# EAGLE schematic longranger-001 (EAGLE 8.7.0)
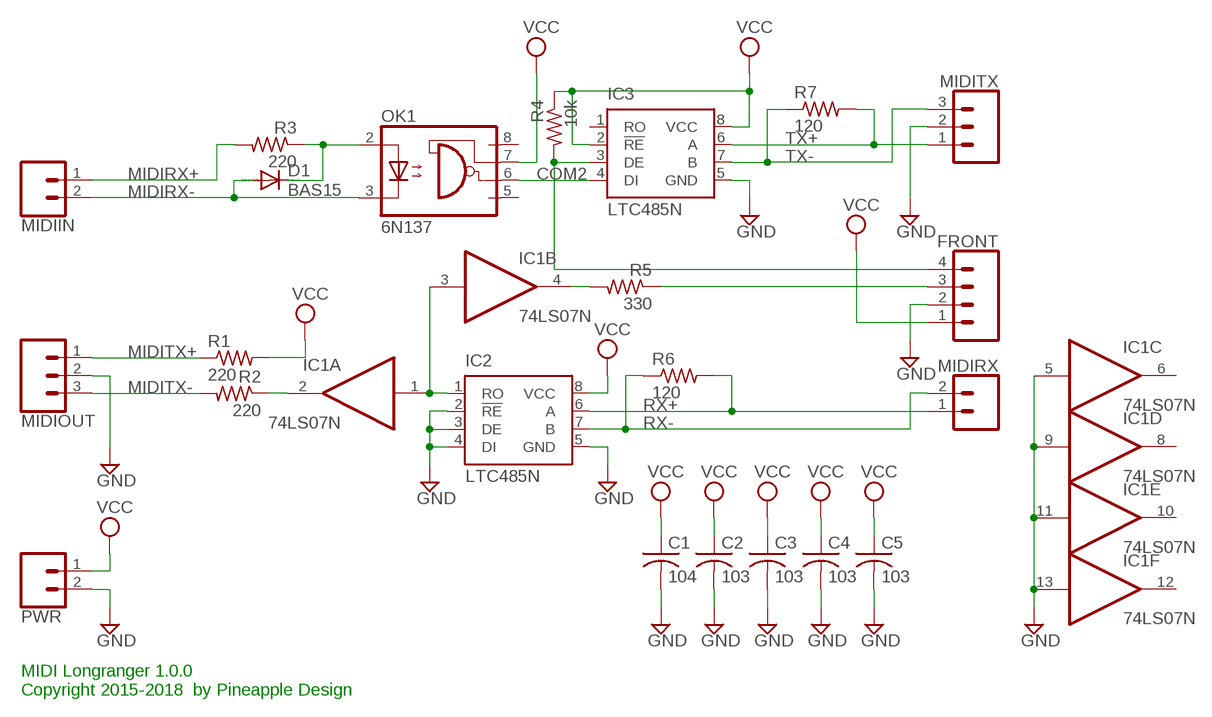
[diagram p0: schematic, sheet 1]

## Parts
C1  104  C-US025-025X050  [C025-025X050]
C2  103  C-US025-025X050  [C025-025X050]
C3  103  C-US025-025X050  [C025-025X050]
C4  103  C-US025-025X050  [C025-025X050]
C5  103  C-US025-025X050  [C025-025X050]
D1  BAS15  [DO34-7]
FRONT  CONN_04JST-PTH  [JST-4-PTH]
IC1  74LS07N  [DIL14]
IC2  LTC485N  [DIL08]
IC3  LTC485N  [DIL08]
MIDIIN  CONN_02JST-PTH-2  [JST-2-PTH]
MIDIOUT  CONN_03JST-PTH  [JST-3-PTH]
MIDIRX  CONN_02JST-PTH-2  [JST-2-PTH]
MIDITX  CONN_03JST-PTH  [JST-3-PTH]
OK1  6N137  [DIL08]
PWR  CONN_02JST-PTH-2  [JST-2-PTH]
R1  220  R-US_0204/5  [0204/5]
R2  220  R-US_0204/5  [0204/5]
R3  220  R-US_0204/5  [0204/5]
R4  10k  R-US_0204/5  [0204/5]
R5  330  R-US_0204/5  [0204/5]
R6  120  R-US_0204/5  [0204/5]
R7  120  R-US_0204/5  [0204/5]

## Nets
COM2: IC3.4(DI) OK1.6(VO)
GND: C1.2 C2.2 C3.2 C4.2 C5.2 FRONT.2 IC1.5(C:I) IC1.9(D:I) IC1.11(E:I) IC1.13(F:I) IC2.2(!RE) IC2.3(DE) IC2.4(DI) IC2.5(GND) IC3.5(GND) MIDIOUT.2 MIDITX.2 PWR.2
MIDIRX+: MIDIIN.1 R3.2
MIDIRX-: D1.A MIDIIN.2 OK1.3(C)
MIDITX+: MIDIOUT.1 R1.1
MIDITX-: MIDIOUT.3 R2.2
N$1: IC1.1(A:I) IC1.3(B:I) IC2.1(RO)
N$2: IC1.2(A:O) R2.1
N$3: IC1.4(B:O) R5.2
N$4: FRONT.3 R5.1
N$6: FRONT.4 IC3.3(DE) R4.2
N$15: D1.C OK1.2(A) R3.1
RX+: IC2.6(A) MIDIRX.1 R6.2
RX-: IC2.7(B) MIDIRX.2 R6.1
TX+: IC3.6(A) MIDITX.1 R7.2
TX-: IC3.7(B) MIDITX.3 R7.1
VCC: C1.1 C2.1 C3.1 C4.1 C5.1 FRONT.1 IC2.8(VCC) IC3.2(!RE) IC3.8(VCC) OK1.7(VE) PWR.1 R1.2 R4.1
Unconnected: IC1.6(C:O) IC1.8(D:O) IC1.10(E:O) IC1.12(F:O) IC3.1(RO) OK1.5(GND) OK1.8(VCC)

## Notes on the sheet
- MIDI Longranger 1.0.0
  Copyright 2015-2018  by Pineapple Design

## Power pins joined to a net without a drawn wire
GND: IC1.7(P:GND)
VCC: IC1.14(P:VCC)

## Library data of the parts
C1-C5 = rcl:C-US: CAPACITOR, American symbol; SPICEPREFIX: C
D1 = diode:BAS15: DIODE high speed
FRONT = SparkFun-Connectors:CONN_04: Multi connection point. Often used as Generic Header-pin footprint for 0.1 inch spaced/style header connections On any of the 0.1 inch spaced packages, you can populate with these: Break Away Headers - Straight <https://www.sparkfun.com/products/116> (PRT-00116) Break Away Male Headers - Right Angle <https://www.sparkfun.com/products/553> (PRT-00553) Female Headers <https://www.sparkfun.com/products/115> (PRT-00115) Break Away Headers - Machine Pin <https://www.sparkfun.com/products/117> (PRT-00117) Break Away Female Headers - Swiss Machine Pin <https://www.sparkfun.com/products/743> (PRT-00743) For SCREWTERMINALS and SPRING TERMINALS visit here: Screw Terimnals on SparkFun.com <https://www.sparkfun.com/search/results?term=Screw+Terminals> (5mm/3.5mm/2.54mm spacing) This device is also useful as a general connection point to wire up your design to another part of your project. Our various solder wires solder well into these plated through hole pads. Hook-Up Wire - Assortment (Stranded, 22 AWG) <https://www.sparkfun.com/products/11375> (PRT-11375) Hook-Up Wire - Assortment (Solid Core, 22 AWG) <https://www.sparkfun.com/products/11367> (PRT-11367) View the entire wire category on our website here <https://www.sparkfun.com/categories/141> Special notes: Molex polarized connector foot print use with SKU : PRT-08231 with associated crimp pins and housings. 1MM SMD Version SKU: PRT-10208; PROD_ID: WIRE-13531; SF_ID: PRT-09916
IC1 = 74xx-us:74*07: Hex BUFFER, open collector high-voltage output
IC2 IC3 = linear-technology:LTC485: Low Power RS485 Interface Transceiver Source: http://www.linear.com/pc/downloadDocument.do?navId=H0,C1,C1007,C1017,P2064,D1718; OC_FARNELL: unknown; OC_NEWARK: unknown
MIDIIN MIDIRX PWR = SparkFun-Connectors:CONN_02: Multi connection point. Often used as Generic Header-pin footprint for 0.1 inch spaced/style header connections On any of the 0.1 inch spaced packages, you can populate with these: Break Away Headers - Straight <https://www.sparkfun.com/products/116> (PRT-00116) Break Away Male Headers - Right Angle <https://www.sparkfun.com/products/553> (PRT-00553) Female Headers <https://www.sparkfun.com/products/115> (PRT-00115) Break Away Headers - Machine Pin <https://www.sparkfun.com/products/117> (PRT-00117) Break Away Female Headers - Swiss Machine Pin <https://www.sparkfun.com/products/743> (PRT-00743) For SCREWTERMINALS and SPRING TERMINALS visit here: Screw Terimnals on SparkFun.com <https://www.sparkfun.com/search/results?term=Screw+Terminals> (5mm/3.5mm/2.54mm spacing) This device is also useful as a general connection point to wire up your design to another part of your project. Our various solder wires solder well into these plated through hole pads. Hook-Up Wire - Assortment (Stranded, 22 AWG) <https://www.sparkfun.com/products/11375> (PRT-11375) Hook-Up Wire - Assortment (Solid Core, 22 AWG) <https://www.sparkfun.com/products/11367> (PRT-11367) View the entire wire category on our website here <https://www.sparkfun.com/categories/141> Special notes: Molex polarized connector foot print use with: PRT-08233 with associated crimp pins and housings. 2.54_SCREWTERM for use with PRT-10571. 3.5mm Screw Terminal footprints for PRT-08084 5mm Screw Terminal footprints for use with PRT-08432; PROD_ID: CONN-09863; SKU: PRT-09914
MIDIOUT MIDITX = SparkFun-Connectors:CONN_03: Multi connection point. Often used as Generic Header-pin footprint for 0.1 inch spaced/style header connections On any of the 0.1 inch spaced packages, you can populate with these: Break Away Headers - Straight <https://www.sparkfun.com/products/116> (PRT-00116) Break Away Male Headers - Right Angle <https://www.sparkfun.com/products/553> (PRT-00553) Female Headers <https://www.sparkfun.com/products/115> (PRT-00115) Break Away Headers - Machine Pin <https://www.sparkfun.com/products/117> (PRT-00117) Break Away Female Headers - Swiss Machine Pin <https://www.sparkfun.com/products/743> (PRT-00743) Stackable Header - 3 Pin (Female, 0.1") <https://www.sparkfun.com/products/13875> (PRT-13875) For SCREWTERMINALS and SPRING TERMINALS visit here: Screw Terimnals on SparkFun.com <https://www.sparkfun.com/search/results?term=Screw+Terminals> (5mm/3.5mm/2.54mm spacing) This device is also useful as a general connection point to wire up your design to another part of your project. Our various solder wires solder well into these plated through hole pads. Hook-Up Wire - Assortment (Stranded, 22 AWG) <https://www.sparkfun.com/products/11375> (PRT-11375) Hook-Up Wire - Assortment (Solid Core, 22 AWG) <https://www.sparkfun.com/products/11367> (PRT-11367) View the entire wire category on our website here <https://www.sparkfun.com/categories/141> Special notes: Molex polarized connector foot print use with SKU : PRT-08232 with associated crimp pins and housings.; PROD_ID: WIRE-10037; SF_ID: PRT-09915
OK1 = optocoupler:6N137: MOTOROLA OPTO COUPLER; MPN: 6N137; OC_FARNELL: 1328376; OC_NEWARK: 52M1895
R1-R7 = resistor:R-US_: RESISTOR, American symbol

## Net classes
0 default: width 0.254 mm, drill 0.254 mm, clearance 0.254 mm